# EAGLE design devkeys (EAGLE 9.6.2)
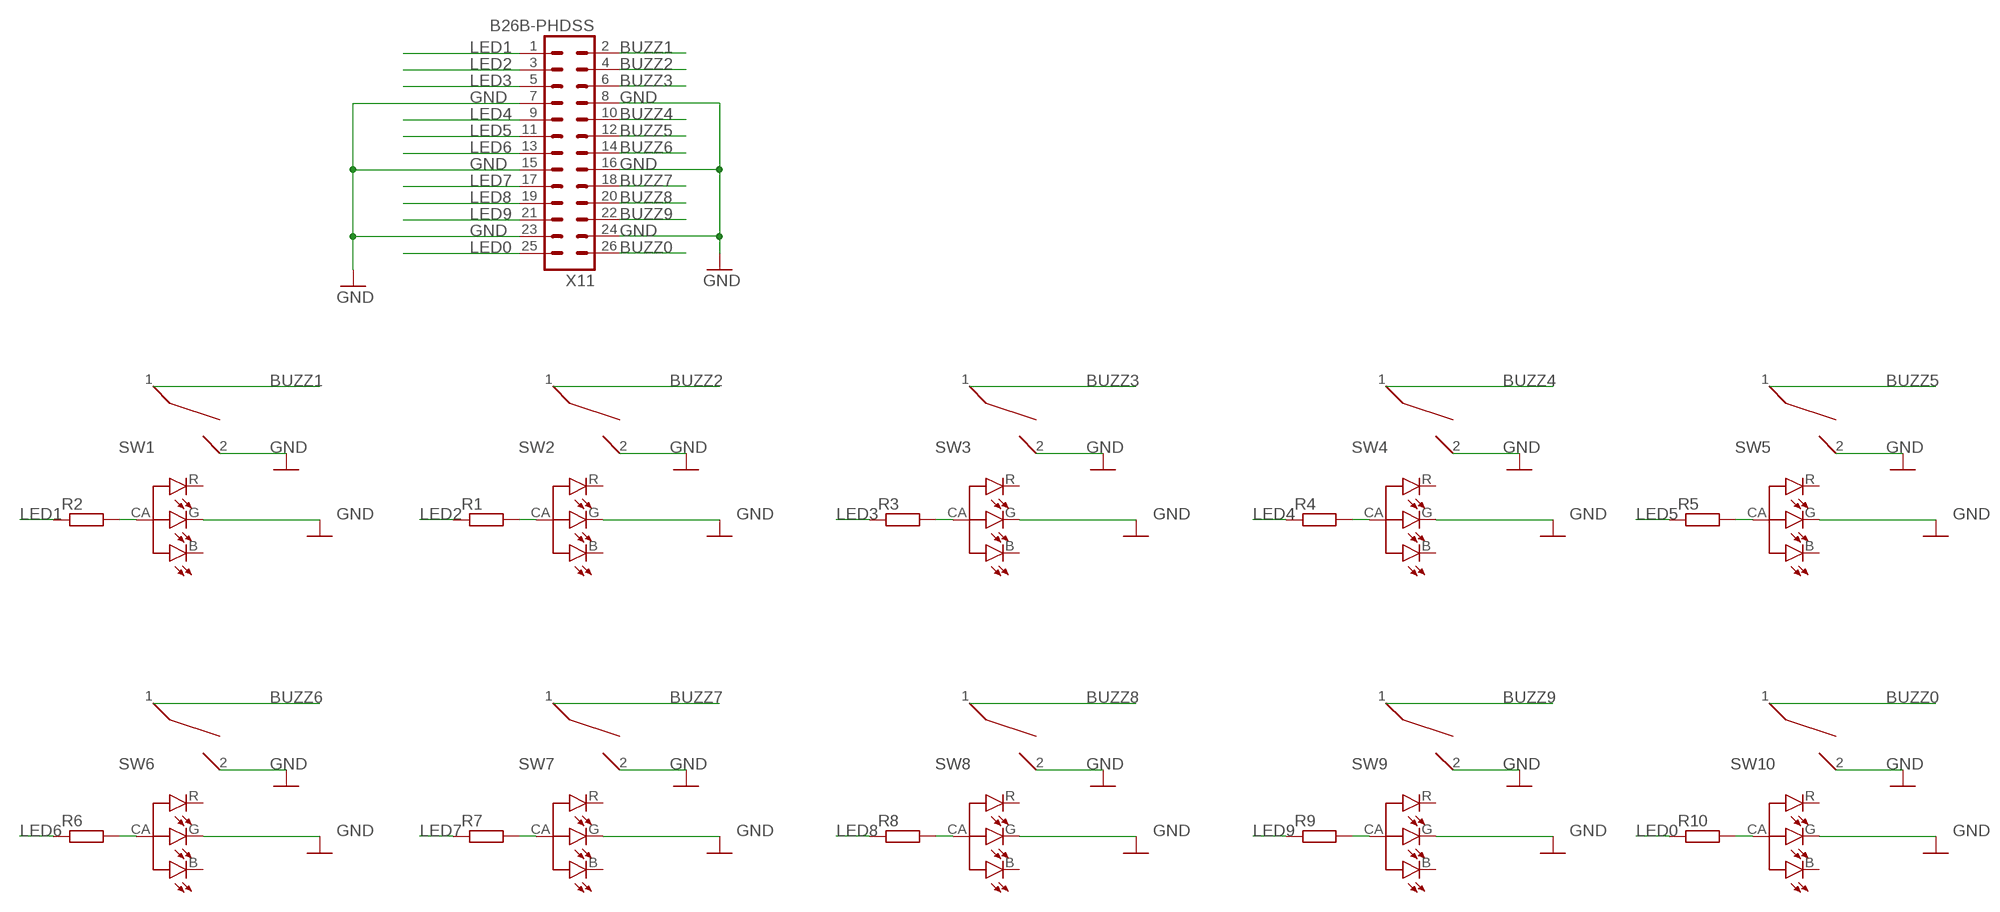
[diagram p0: schematic, sheet 1]

## Parts
R1  R-EU_R0805  [R0805]
R2  R-EU_R0805  [R0805]
R3  R-EU_R0805  [R0805]
R4  R-EU_R0805  [R0805]
R5  R-EU_R0805  [R0805]
R6  R-EU_R0805  [R0805]
R7  R-EU_R0805  [R0805]
R8  R-EU_R0805  [R0805]
R9  R-EU_R0805  [R0805]
R10  R-EU_R0805  [R0805]
SW1  ZEALIOS  [ZEALIOS-PCB_1U]
SW2  ZEALIOS  [ZEALIOS-PCB_1U]
SW3  ZEALIOS  [ZEALIOS-PCB_1U]
SW4  ZEALIOS  [ZEALIOS-PCB_1U]
SW5  ZEALIOS  [ZEALIOS-PCB_1U]
SW6  ZEALIOS  [ZEALIOS-PCB_1U]
SW7  ZEALIOS  [ZEALIOS-PCB_1U]
SW8  ZEALIOS  [ZEALIOS-PCB_1U]
SW9  ZEALIOS  [ZEALIOS-PCB_1U]
SW10  ZEALIOS  [ZEALIOS-PCB_1U]
X11  B26B-PHDSS  [B26B-PHDSS]

## Nets
BUZZ0: SW10.1 X11.26
BUZZ1: SW1.1 X11.2
BUZZ2: SW2.1 X11.4
BUZZ3: SW3.1 X11.6
BUZZ4: SW4.1 X11.10
BUZZ5: SW5.1 X11.12
BUZZ6: SW6.1 X11.14
BUZZ7: SW7.1 X11.18
BUZZ8: SW8.1 X11.20
BUZZ9: SW9.1 X11.22
GND: SW1.2 SW1.G(G-CAT) SW2.2 SW2.G(G-CAT) SW3.2 SW3.G(G-CAT) SW4.2 SW4.G(G-CAT) SW5.2 SW5.G(G-CAT) SW6.2 SW6.G(G-CAT) SW7.2 SW7.G(G-CAT) SW8.2 SW8.G(G-CAT) SW9.2 SW9.G(G-CAT) SW10.2 SW10.G(G-CAT) X11.7 X11.8 X11.15 X11.16 X11.23 X11.24
LED0: R10.1 X11.25
LED1: R2.1 X11.1
LED2: R1.1 X11.3
LED3: R3.1 X11.5
LED4: R4.1 X11.9
LED5: R5.1 X11.11
LED6: R6.1 X11.13
LED7: R7.1 X11.17
LED8: R8.1 X11.19
LED9: R9.1 X11.21
N$1: R1.2 SW2.CA(COMMON-ANODE)
N$2: R2.2 SW1.CA(COMMON-ANODE)
N$3: R3.2 SW3.CA(COMMON-ANODE)
N$4: R4.2 SW4.CA(COMMON-ANODE)
N$5: R5.2 SW5.CA(COMMON-ANODE)
N$6: R6.2 SW6.CA(COMMON-ANODE)
N$7: R7.2 SW7.CA(COMMON-ANODE)
N$8: R8.2 SW8.CA(COMMON-ANODE)
N$9: R9.2 SW9.CA(COMMON-ANODE)
N$10: R10.2 SW10.CA(COMMON-ANODE)
Unconnected: SW1.B(B-CAT) SW1.R(R-CAT) SW2.B(B-CAT) SW2.R(R-CAT) SW3.B(B-CAT) SW3.R(R-CAT) SW4.B(B-CAT) SW4.R(R-CAT) SW5.B(B-CAT) SW5.R(R-CAT) SW6.B(B-CAT) SW6.R(R-CAT) SW7.B(B-CAT) SW7.R(R-CAT) SW8.B(B-CAT) SW8.R(R-CAT) SW9.B(B-CAT) SW9.R(R-CAT) SW10.B(B-CAT) SW10.R(R-CAT)

## Library data of the parts
R1-R10 = resistor:R-EU_: RESISTOR, European symbol
SW1-SW10 = Cherry_MX_v7.0:ZEALIOS
X11 = con-JST PHD:B26B-PHDSS: JST PHD series header 2.00mm pitch disconnectable crimp style connectors, vertical (side entry type), 26 pins

## Net classes
0 default: width 0.3 mm, clearance 0.205 mm

## Board
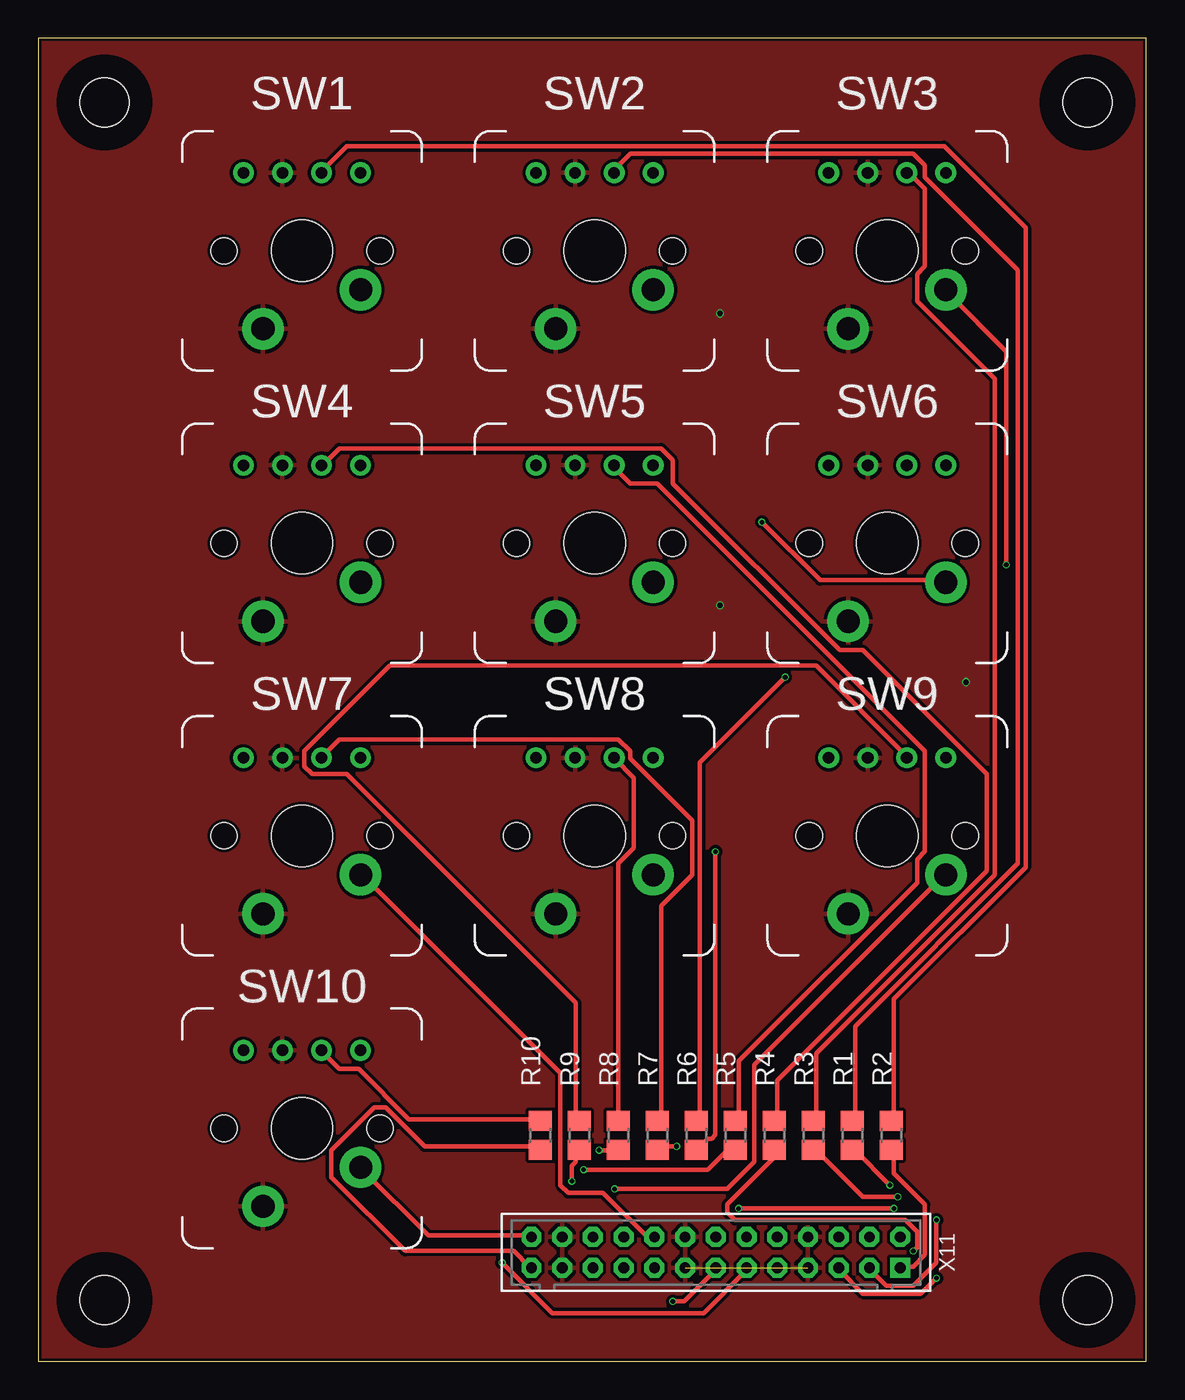
[diagram p1: board, top side]
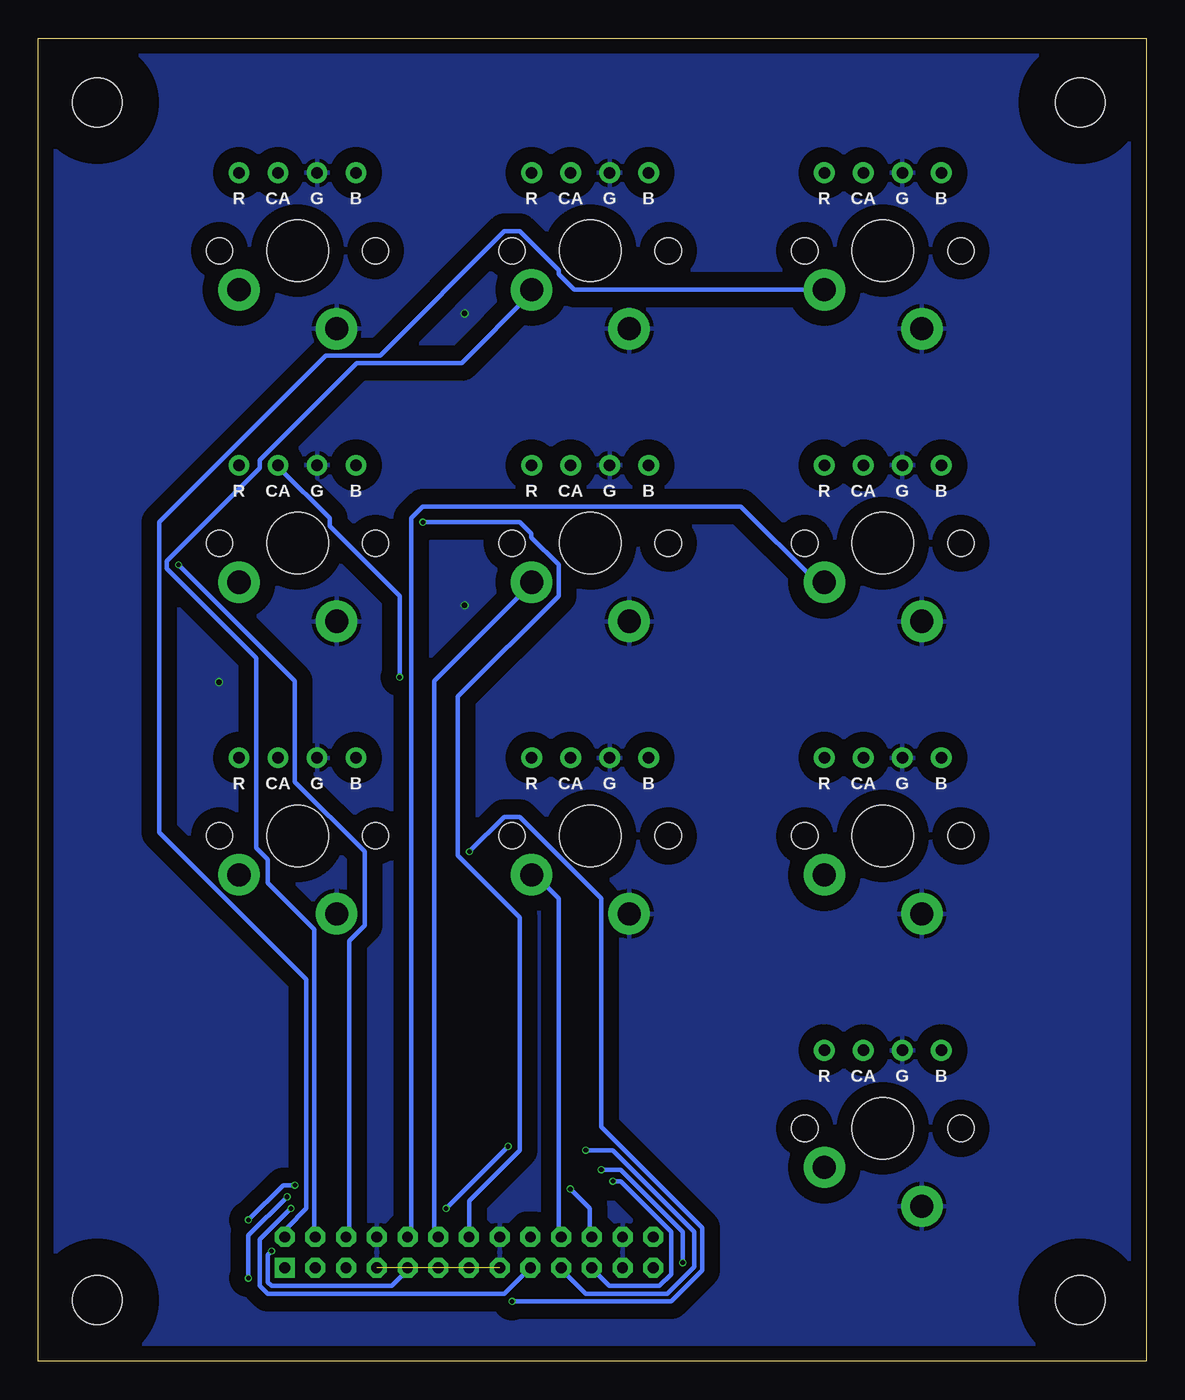
[diagram p2: board, bottom side, seen from below]

Size 72.13 x 86.14 mm. Coordinates in mm from the lower left corner, seen from the top.
Outline: 0,0 72.13,0 72.13,86.14 0,86.14 0,0
Copper layers (1*16): Top 0.035mm / dielectric 1.6mm / Bottom 0.035mm
Design rules "jlcpcb-2layers": minimum track width 5mil, minimum drill 0.3mm, track to track 5mil, track to pad 5mil, pad to pad 5mil, via to via 5mil, smd to smd 5mil, copper to edge 0.2mm, drill to drill 6mil, minimum pad ring 10mil, minimum via ring 3mil, stop-mask expansion 4mil, vias tented up to drill 0mil, thermal gap 10mil

### Footprints (pad centres in the part's own frame; a part is rotated, then mirrored left to right if it is on the bottom)
R0805 = smd 1.3 x 1.5: 1 -0.95,0; 2 0.95,0
ZEALIOS-PCB_1U = drill 1.5: 1 -3.81,2.54; 2 2.54,5.08 | drill 0.75: B 3.81,-5.08; CA -1.27,-5.08; G 1.27,-5.08; R -3.81,-5.08 | hole 4: 0,0 | hole 1.7: -5.08,0; 5.08,0
M3-HOLE = hole 3.2: 0,0
B26B-PHDSS = drill 0.7 pad 1.3 square: 1 12,-1 | drill 0.7 pad 1.3 octagon: 2 12,1; 3 10,-1; 4 10,1; 5 8,-1; 6 8,1; 7 6,-1; 8 6,1; 9 4,-1; 10 4,1; 11 2,-1; 12 2,1; 13 0,-1; 14 0,1; 15 -2,-1; 16 -2,1; 17 -4,-1; 18 -4,1; 19 -6,-1; 20 -6,1; 21 -8,-1; 22 -8,1; 23 -10,-1; 24 -10,1; 25 -12,-1; 26 -12,1

### Placement (x,y rotation side)
R1  52.99,14.7 90 top
R2  55.53,14.7 90 top
R3  50.45,14.7 90 top
R4  47.91,14.7 90 top
R5  45.37,14.7 90 top
R6  42.83,14.7 90 top
R7  40.29,14.7 90 top
R8  37.75,14.7 90 top
R9  35.21,14.7 90 top
R10  32.67,14.7 90 top
SW1  17.16,72.31 180 top
SW2  36.21,72.31 180 top
SW3  55.26,72.31 180 top
SW4  17.16,53.26 180 top
SW5  36.21,53.26 180 top
SW6  55.26,53.26 180 top
SW7  17.16,34.21 180 top
SW8  36.21,34.21 180 top
SW9  55.26,34.21 180 top
SW10  17.16,15.16 180 top
U$1  [M3-HOLE]  68.3,81.97 0 top
U$2  [M3-HOLE]  4.3,81.97 0 top
U$3  [M3-HOLE]  4.3,3.97 0 top
U$4  [M3-HOLE]  68.3,3.97 0 top
X11  44.1,7.08 0 top

### Tracks (layer width: path | path; a pad name or v marks a point on that pad's centre or on a via)
BUZZ0
  Top 0.3: X11.26 31.95,8.18 25.39,8.18 21.09,12.47 SW10.1
BUZZ1
  Bottom 0.3: X11.2 55.94,8.18 55.94,8.68 54.68,9.95 54.68,24.84 64.27,34.44 64.27,54.64 53.41,65.5 49.88,65.5 41.8,73.58 40.79,73.58 38.27,71.05 38.27,70.8 37.26,69.79 21.09,69.79 SW1.1
BUZZ2
  Bottom 0.3: X11.4 54.17,8.18 54.17,28.12 57.2,31.16 57.2,32.67 57.96,33.43 57.96,45.8 63.77,51.61 63.77,52.11 57.71,58.17 57.71,58.68 51.4,64.99 44.58,64.99 40.03,69.53 SW2.1
BUZZ3  (via drill 0.3)
  Top 0.3: v63.01,51.86 63.01,65.75 59.22,69.53 SW3.1
  Bottom 0.3: v63.01,51.86 55.44,44.28 55.44,37.72 50.89,33.17 50.89,28.38 51.9,27.37 51.9,8.18 X11.6
BUZZ4
  Bottom 0.3: X11.10 47.86,8.18 47.86,54.89 47.1,55.65 26.4,55.65 21.6,50.85 21.09,50.85 SW4.1
BUZZ5
  Bottom 0.3: X11.12 46.35,8.18 46.35,44.28 40.03,50.6 SW5.1
BUZZ6  (via drill 0.3)
  Top 0.3: v47.1,54.64 50.89,50.85 58.97,50.85 SW6.1
  Bottom 0.3: v47.1,54.64 40.79,54.64 40.03,53.88 40.03,53.63 38.27,51.86 38.27,49.84 44.83,43.27 44.83,32.92 40.79,28.88 40.79,13.73 44.07,10.45 44.07,8.18 X11.14
BUZZ7
  Top 0.3: X11.18 40.03,8.18 39.53,8.18 36.75,10.96 34.48,10.96 33.97,11.46 33.97,18.78 21.09,31.66 SW7.1
BUZZ8
  Bottom 0.3: X11.20 38.27,8.18 38.27,30.14 39.78,31.66 SW8.1
BUZZ9  (via drill 0.3)
  Top 0.3: v37.51,11.21 44.83,11.21 46.6,12.97 46.6,19.29 58.97,31.66 SW9.1
  Bottom 0.3: v37.51,11.21 36.25,9.95 36.25,8.18 X11.22
GND  (via drill 0.35)  (1 unrouted)
  other vias: 44.38,68.22 44.38,49.22 60.38,44.22
  pour Top (isolate 0.1): -2.62,-6.78 -2.62,87.22 73.38,87.22 73.38,-6.78
  pour Bottom (isolate 1): -4.62,87.22 -4.62,-6.78 73.38,-6.78 73.38,87.22
LED0
  Top 0.3: R10.1 32.46,13.99 25.13,13.99 22.61,16.51 21.85,16.51 19.07,13.73 19.07,11.97 23.87,7.17 30.94,7.17 31.95,6.16 X11.25
LED1
  Top 0.3: R2.1 55.69,13.73 55.69,12.22 57.71,10.2 57.71,6.92 56.95,6.16 56.19,6.16 X11.1
LED2  (via drill 0.3)
  Top 0.3: v55.44,11.46 53.16,13.73 R1.1 | v58.47,9.19 58.47,6.41 56.95,4.9 55.18,4.9 54.17,5.9 X11.3
  Bottom 0.3: v55.44,11.46 56.19,11.46 v58.47,9.19
LED3  (via drill 0.3)
  Top 0.3: v55.94,10.7 53.67,10.7 50.64,13.73 R3.1 | v58.47,5.4 57.46,4.39 53.67,4.39 52.15,5.9 X11.5
  Bottom 0.3: v55.94,10.7 58.47,8.18 v58.47,5.4
LED4  (via drill 0.3)
  Top 0.3: v56.95,7.17 57.2,7.42 57.2,8.43 56.45,9.19 45.34,9.19 44.83,9.69 44.83,10.2 47.86,13.23 47.86,13.73 R4.1
  Bottom 0.3: v56.95,7.17 57.2,6.92 57.2,5.15 56.95,4.9 49.12,4.9 48.11,5.9 X11.9
LED5  (via drill 0.3)
  Top 0.3: v35.49,12.47 43.57,12.47 44.83,13.73 45.34,13.73 R5.1 | v30.18,6.41 33.47,3.13 43.32,3.13 46.09,5.9 X11.11
  Bottom 0.3: v35.49,12.47 34.23,12.47 30.18,8.43 v30.18,6.41
LED6  (via drill 0.3)
  Top 0.3: v44.07,33.17 44.07,14.74 43.82,14.49 43.57,14.49 43.06,13.99 R6.1 | v41.3,3.88 42.05,3.88 44.07,5.9 X11.13
  Bottom 0.3: v44.07,33.17 41.8,35.45 40.79,35.45 35.49,30.14 35.49,15.25 28.92,8.68 28.92,5.9 30.94,3.88 v41.3,3.88
LED7  (via drill 0.3)
  Top 0.3: v41.55,13.99 40.54,13.99 R7.1 | v55.69,9.95 v45.59,9.95
  Bottom 0.3: v45.59,9.95 v41.55,13.99 | v55.69,9.95 57.71,7.92 57.71,4.9 57.2,4.39 41.8,4.39 40.29,5.9 X11.17
LED8  (via drill 0.3)
  Top 0.3: v36.5,13.73 37.51,13.73 R8.1
  Bottom 0.3: v36.5,13.73 34.73,13.73 29.43,8.43 29.43,6.16 31.2,4.39 36.5,4.39 38.01,5.9 X11.19
LED9  (via drill 0.3)
  Top 0.3: v34.73,11.71 34.73,12.72 34.98,12.97 34.98,13.73 R9.1
  Bottom 0.3: v34.73,11.71 34.23,11.71 30.94,8.43 30.94,5.65 31.7,4.9 34.98,4.9 35.99,5.9 X11.21
N$1
  Top 0.3: R1.2 53.16,15.75 53.16,21.81 63.77,32.42 63.77,71.05 57.71,77.11 57.71,77.87 56.95,78.62 38.52,78.62 37.51,77.61 SW2.CA
N$2
  Top 0.3: R2.2 55.69,15.75 55.69,23.58 64.27,32.16 64.27,73.83 58.97,79.13 20.08,79.13 18.57,77.61 SW1.CA
N$3
  Top 0.3: R3.2 50.64,15.75 50.64,20.05 62.25,31.66 62.25,63.98 57.2,69.03 57.2,70.8 57.71,71.3 57.71,76.35 56.7,77.36 SW3.CA
N$4
  Top 0.3: R4.2 48.11,15.75 48.11,18.28 61.75,31.91 61.75,38.23 53.67,46.3 52.15,46.3 41.3,57.16 41.3,58.68 40.54,59.44 19.58,59.44 18.57,58.42 SW4.CA
N$5
  Top 0.3: R5.2 45.59,15.75 45.59,19.54 57.2,31.16 57.2,32.67 57.71,33.17 57.71,39.74 40.29,57.16 38.52,57.16 37.51,58.17 SW5.CA
N$6  (via drill 0.3)
  Top 0.3: v48.62,44.54 43.06,38.98 43.06,15.75 R6.2
  Bottom 0.3: v48.62,44.54 48.62,49.84 53.16,54.39 53.16,54.89 56.45,58.17 SW6.CA
N$7
  Top 0.3: R7.2 40.54,15.75 40.54,29.64 42.56,31.66 42.56,35.2 38.52,39.23 38.52,39.74 37.76,40.5 19.58,40.5 18.57,39.49 SW7.CA
N$8
  Top 0.3: R8.2 37.76,15.75 37.76,32.42 38.77,33.43 38.77,37.97 37.51,39.23 SW8.CA
N$9
  Top 0.3: R9.2 34.98,15.75 34.98,23.33 20.08,38.23 17.81,38.23 17.31,38.73 17.31,39.74 22.86,45.3 50.64,45.3 56.45,39.49 SW9.CA
N$10
  Top 0.3: R10.2 32.46,15.75 24.12,15.75 20.84,19.04 19.58,19.04 18.57,20.05 SW10.CA

### Text on the board
tValues: DevKeys 1.0 | GoeffelDevices | 2021